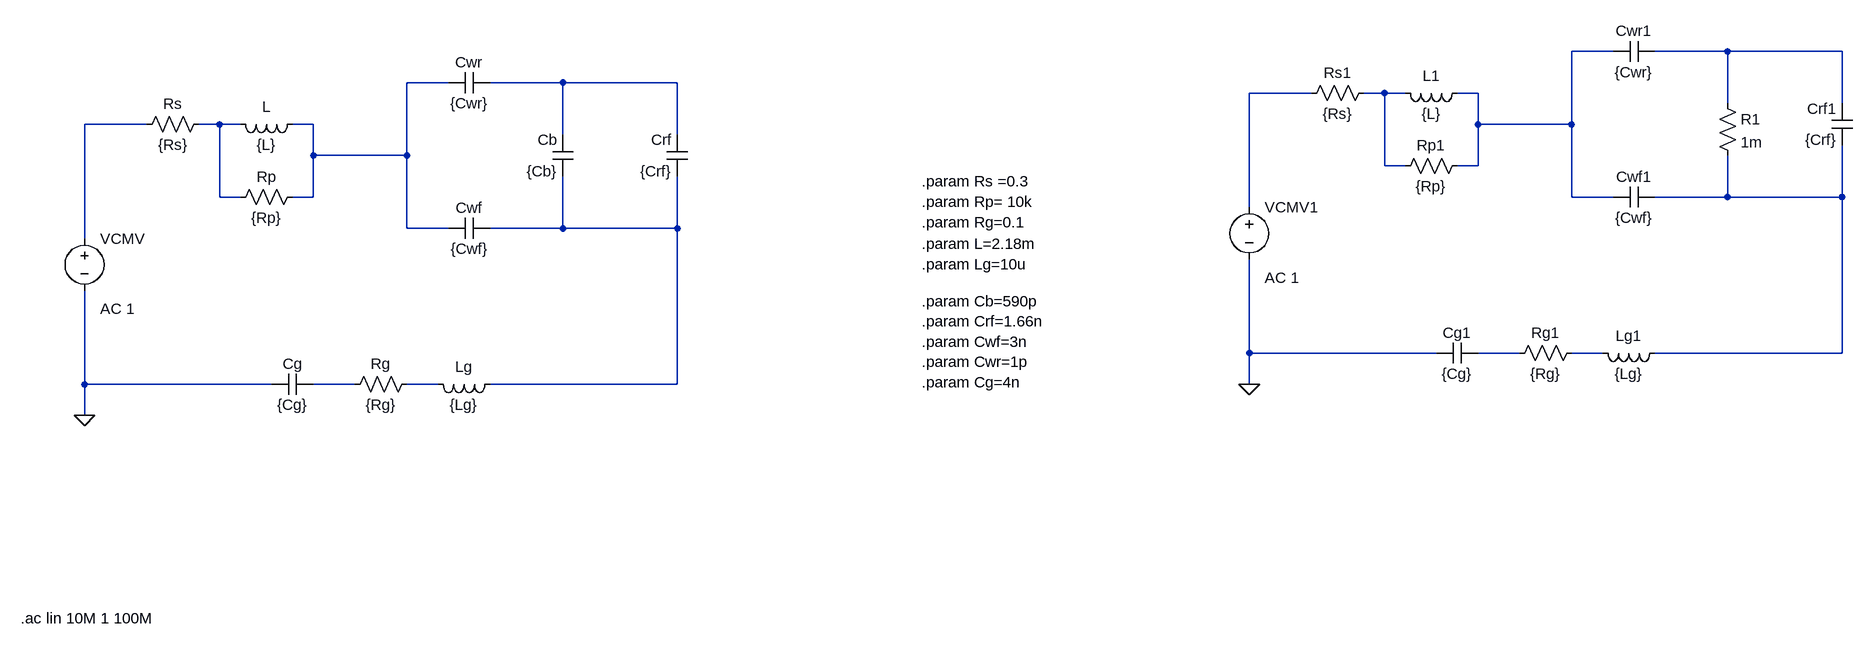
[diagram p0: schematic Draft1.asc]
Draft1.asc, the LTspice schematic file:
Version 4
SHEET 1 2532 968
WIRE 2160 80 2096 80
WIRE 2336 80 2224 80
WIRE 2512 80 2336 80
WIRE 368 128 304 128
WIRE 544 128 432 128
WIRE 720 128 544 128
WIRE 1696 144 1600 144
WIRE 1808 144 1776 144
WIRE 1840 144 1808 144
WIRE 1952 144 1920 144
WIRE 2336 160 2336 80
WIRE 2512 160 2512 80
WIRE -96 192 -192 192
WIRE 16 192 -16 192
WIRE 48 192 16 192
WIRE 160 192 128 192
WIRE 1952 192 1952 144
WIRE 2096 192 2096 80
WIRE 2096 192 1952 192
WIRE 544 208 544 128
WIRE 720 208 720 128
WIRE 160 240 160 192
WIRE 304 240 304 128
WIRE 304 240 160 240
WIRE 1808 256 1808 144
WIRE 1840 256 1808 256
WIRE 1952 256 1952 192
WIRE 1952 256 1920 256
WIRE 16 304 16 192
WIRE 48 304 16 304
WIRE 160 304 160 240
WIRE 160 304 128 304
WIRE 2096 304 2096 192
WIRE 2160 304 2096 304
WIRE 2336 304 2336 240
WIRE 2336 304 2224 304
WIRE 2512 304 2512 224
WIRE 2512 304 2336 304
WIRE 1600 320 1600 144
WIRE 304 352 304 240
WIRE 368 352 304 352
WIRE 544 352 544 272
WIRE 544 352 432 352
WIRE 720 352 720 272
WIRE 720 352 544 352
WIRE -192 368 -192 192
WIRE 1600 544 1600 400
WIRE 1888 544 1600 544
WIRE 2016 544 1952 544
WIRE 2144 544 2096 544
WIRE 2512 544 2512 304
WIRE 2512 544 2224 544
WIRE -192 592 -192 448
WIRE 96 592 -192 592
WIRE 224 592 160 592
WIRE 352 592 304 592
WIRE 720 592 720 352
WIRE 720 592 432 592
WIRE 1600 592 1600 544
WIRE -192 640 -192 592
FLAG -192 640 0
FLAG 1600 592 0
SYMBOL voltage -192 352 R0
WINDOW 123 24 124 Left 2
WINDOW 39 0 0 Left 0
SYMATTR InstName VCMV
SYMATTR Value ""
SYMATTR Value2 AC 1
SYMBOL res 0 176 R90
WINDOW 0 0 56 VBottom 2
WINDOW 3 32 56 VTop 2
SYMATTR InstName Rs
SYMATTR Value {Rs}
SYMBOL ind 144 176 R90
WINDOW 0 5 56 VBottom 2
WINDOW 3 32 56 VTop 2
SYMATTR InstName L
SYMATTR Value {L}
SYMBOL res 144 288 R90
WINDOW 0 0 56 VBottom 2
WINDOW 3 32 56 VTop 2
SYMATTR InstName Rp
SYMATTR Value {Rp}
SYMBOL cap 160 576 R90
WINDOW 0 0 32 VBottom 2
WINDOW 3 32 32 VTop 2
SYMATTR InstName Cg
SYMATTR Value {Cg}
SYMBOL res 320 576 R90
WINDOW 0 0 56 VBottom 2
WINDOW 3 32 56 VTop 2
SYMATTR InstName Rg
SYMATTR Value {Rg}
SYMBOL ind 448 576 R90
WINDOW 0 5 56 VBottom 2
WINDOW 3 32 56 VTop 2
SYMATTR InstName Lg
SYMATTR Value {Lg}
SYMBOL cap 432 112 R90
WINDOW 0 0 32 VBottom 2
WINDOW 3 32 32 VTop 2
SYMATTR InstName Cwr
SYMATTR Value {Cwr}
SYMBOL cap 432 336 R90
WINDOW 0 0 32 VBottom 2
WINDOW 3 32 32 VTop 2
SYMATTR InstName Cwf
SYMATTR Value {Cwf}
SYMBOL cap 560 272 R180
WINDOW 0 24 56 Left 2
WINDOW 3 24 8 Left 2
SYMATTR InstName Cb
SYMATTR Value {Cb}
SYMBOL cap 736 272 R180
WINDOW 0 24 56 Left 2
WINDOW 3 24 8 Left 2
SYMATTR InstName Crf
SYMATTR Value {Crf}
SYMBOL voltage 1600 304 R0
WINDOW 123 24 124 Left 2
WINDOW 39 0 0 Left 0
SYMATTR InstName VCMV1
SYMATTR Value ""
SYMATTR Value2 AC 1
SYMBOL res 1792 128 R90
WINDOW 0 0 56 VBottom 2
WINDOW 3 32 56 VTop 2
SYMATTR InstName Rs1
SYMATTR Value {Rs}
SYMBOL ind 1936 128 R90
WINDOW 0 5 56 VBottom 2
WINDOW 3 32 56 VTop 2
SYMATTR InstName L1
SYMATTR Value {L}
SYMBOL res 1936 240 R90
WINDOW 0 0 56 VBottom 2
WINDOW 3 32 56 VTop 2
SYMATTR InstName Rp1
SYMATTR Value {Rp}
SYMBOL cap 1952 528 R90
WINDOW 0 0 32 VBottom 2
WINDOW 3 32 32 VTop 2
SYMATTR InstName Cg1
SYMATTR Value {Cg}
SYMBOL res 2112 528 R90
WINDOW 0 0 56 VBottom 2
WINDOW 3 32 56 VTop 2
SYMATTR InstName Rg1
SYMATTR Value {Rg}
SYMBOL ind 2240 528 R90
WINDOW 0 5 56 VBottom 2
WINDOW 3 32 56 VTop 2
SYMATTR InstName Lg1
SYMATTR Value {Lg}
SYMBOL cap 2224 64 R90
WINDOW 0 0 32 VBottom 2
WINDOW 3 32 32 VTop 2
SYMATTR InstName Cwr1
SYMATTR Value {Cwr}
SYMBOL cap 2224 288 R90
WINDOW 0 0 32 VBottom 2
WINDOW 3 32 32 VTop 2
SYMATTR InstName Cwf1
SYMATTR Value {Cwf}
SYMBOL cap 2528 224 R180
WINDOW 0 24 56 Left 2
WINDOW 3 24 8 Left 2
SYMATTR InstName Crf1
SYMATTR Value {Crf}
SYMBOL res 2320 144 R0
SYMATTR InstName R1
SYMATTR Value 1m
TEXT 1096 280 Left 2 !.param Rs =0.3\n.param Rp= 10k\n.param Rg=0.1
TEXT 1096 376 Left 2 !.param L=2.18m\n.param Lg=10u
TEXT 1096 464 Left 2 !.param Cb=590p\n.param Crf=1.66n\n.param Cwf=3n\n.param Cwr=1p\n.param Cg=4n
TEXT -290 952 Left 2 !.ac lin 10M 1 100M

The netlist it stands for:
* Draft1.asc
VCMV N007 0 AC 1
Rs N008 N007 {Rs}
L N003 N008 {L}
Rp N003 N008 {Rp}
Cg N013 0 {Cg}
Rg N014 N013 {Rg}
Lg N010 N014 {Lg}
Cwr N004 N003 {Cwr}
Cwf N010 N003 {Cwf}
Cb N010 N004 {Cb}
Crf N010 N004 {Crf}
VCMV1 N005 0 AC 1
Rs1 N006 N005 {Rs}
L1 N001 N006 {L}
Rp1 N001 N006 {Rp}
Cg1 N011 0 {Cg}
Rg1 N012 N011 {Rg}
Lg1 N009 N012 {Lg}
Cwr1 N002 N001 {Cwr}
Cwf1 N009 N001 {Cwf}
Crf1 N009 N002 {Crf}
R1 N002 N009 1m
.param Rs =0.3
.param Rp= 10k
.param Rg=0.1
.param L=2.18m
.param Lg=10u
.param Cb=590p
.param Crf=1.66n
.param Cwf=3n
.param Cwr=1p
.param Cg=4n
.ac lin 10M 1 100M
.backanno
.end